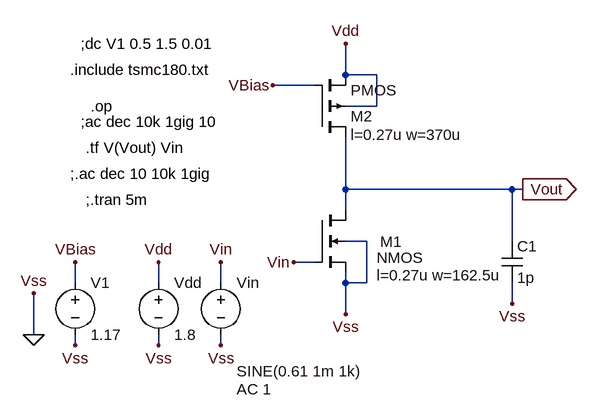
[diagram p0: schematic CS_amp_with_active_load_pres.asc]
CS_amp_with_active_load_pres.asc, the LTspice schematic file:
Version 4
SHEET 1 1472 680
WIRE 432 -112 432 -160
WIRE 480 -112 432 -112
WIRE 384 -96 320 -96
WIRE 480 -64 480 -112
WIRE 480 -64 432 -64
WIRE 432 64 432 -16
WIRE 688 64 432 64
WIRE 704 64 688 64
WIRE 432 96 432 64
WIRE 464 144 432 144
WIRE 688 144 688 64
WIRE 384 176 352 176
WIRE 16 208 16 176
WIRE 144 208 144 176
WIRE 240 208 240 176
WIRE 432 208 432 192
WIRE 464 208 464 144
WIRE 464 208 432 208
WIRE 688 240 688 208
WIRE 432 256 432 208
WIRE -48 288 -48 224
WIRE 16 304 16 288
WIRE 144 304 144 288
WIRE 240 304 240 288
FLAG -48 288 0
FLAG -48 224 Vss
FLAG 240 176 Vin
FLAG 144 304 Vss
FLAG 240 304 Vss
FLAG 144 176 Vdd
FLAG 432 -160 Vdd
FLAG 352 176 Vin
FLAG 432 256 Vss
FLAG 704 64 Vout
IOPIN 704 64 Out
FLAG 688 240 Vss
FLAG 320 -96 VBias
FLAG 16 304 Vss
FLAG 16 176 VBias
DATAFLAG 448 64 ""
SYMBOL nmos4 384 96 R0
WINDOW 0 101 49 Left 2
WINDOW 3 96 73 Left 2
WINDOW 123 96 100 Left 2
SYMATTR InstName M1
SYMATTR Value2 l=0.27u w=162.5u
SYMBOL voltage 144 192 R0
WINDOW 123 0 0 Left 0
WINDOW 39 0 0 Left 0
SYMATTR InstName Vdd
SYMATTR Value 1.8
SYMBOL voltage 240 192 R0
WINDOW 3 24 152 Left 2
WINDOW 123 24 180 Left 2
WINDOW 39 0 0 Left 0
SYMATTR Value SINE(0.61 1m 1k)
SYMATTR Value2 AC 1
SYMATTR InstName Vin
SYMBOL cap 672 144 R0
SYMATTR InstName C1
SYMATTR Value 1p
SYMBOL pmos4 384 -16 M180
WINDOW 123 56 4 Left 2
SYMATTR Value2 l=0.27u w=370u
SYMATTR InstName M2
SYMBOL voltage 16 192 R0
SYMATTR InstName V1
SYMATTR Value 1.17
TEXT 8 -120 Left 2 !.include tsmc180.txt
TEXT 40 -64 Left 2 !.op
TEXT 24 -40 Left 2 !;ac dec 10k 1gig 10
TEXT 32 0 Left 2 !.tf V(Vout) Vin
TEXT 8 40 Left 2 !;.ac dec 10 10k 1gig
TEXT 32 80 Left 2 !;.tran 5m
TEXT 24 -160 Left 2 !;dc V1 0.5 1.5 0.01

The netlist it stands for:
* CS_amp_with_active_load_pres.asc
M1 Vout Vin 0 0 NMOS l=0.27u w=162.5u
Vdd Vdd 0 1.8
Vin Vin 0 SINE(0.61 1m 1k) AC 1
C1 Vout 0 1p
M2 Vout VBias Vdd Vdd PMOS l=0.27u w=370u
V1 VBias 0 1.17
.model NMOS NMOS
.model PMOS PMOS
.lib standard.mos
.include tsmc180.txt
.op
;ac dec 10k 1gig 10
.tf V(Vout) Vin
;.ac dec 10 10k 1gig
;.tran 5m
;dc V1 0.5 1.5 0.01
.backanno
.end